# EAGLE design Rs232Iso-v1.1 (EAGLE 6.4)
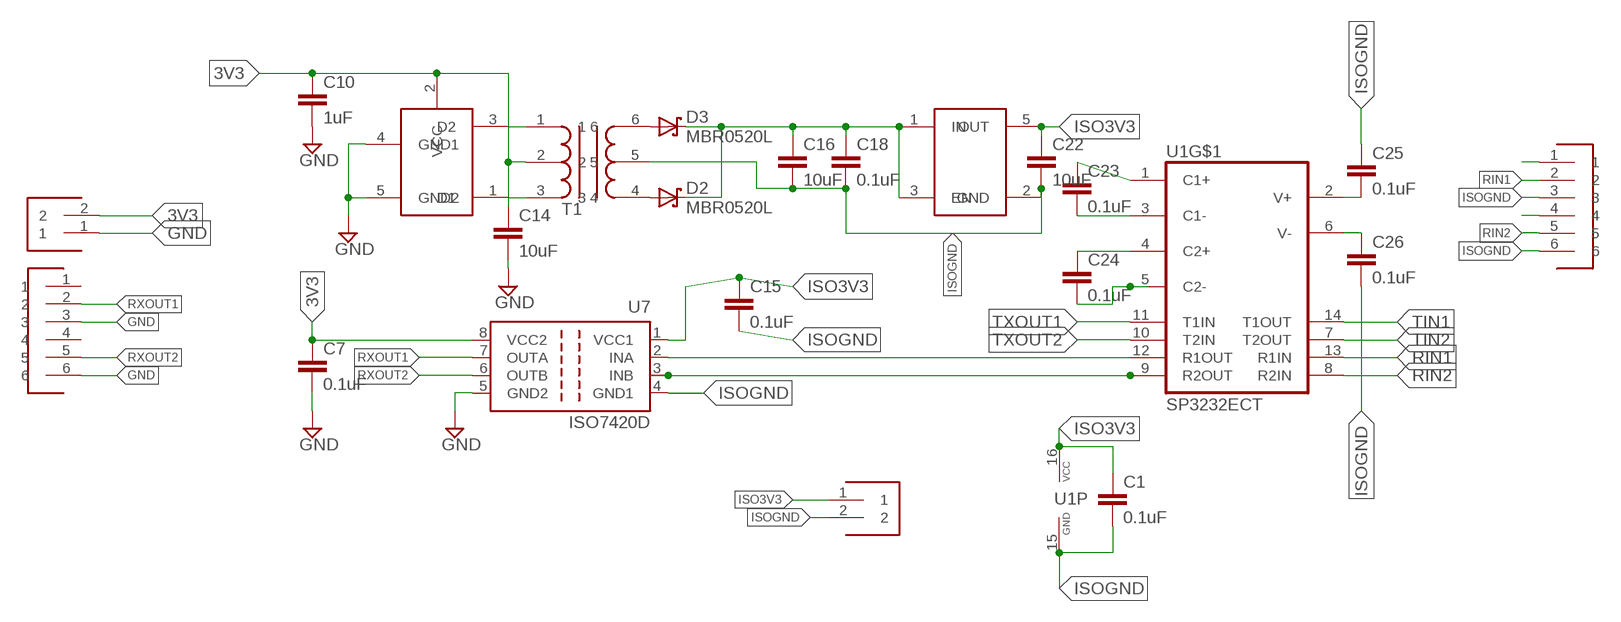
[diagram p0: schematic, sheet 1]

## Parts
C1  0.1uF  CAP0805  [0805]
C7  0.1uF  CAP0805  [0805]
C10  1uF  CAP0805  [0805]
C14  10uF  CAP0805  [0805]
C15  0.1uF  CAP0805  [0805]
C16  10uF  CAP0805  [0805]
C18  0.1uF  CAP0805  [0805]
C22  10uF  CAP0805  [0805]
C23  0.1uF  CAP0805  [0805]
C24  0.1uF  CAP0805  [0805]
C25  0.1uF  CAP0805  [0805]
C26  0.1uF  CAP0805  [0805]
D2  MBR0520L  [SOD123]
D3  MBR0520L  [SOD123]
J1  CON-2  [CON-2]
J2  CON-6  [CON-6]
J3  CON-2  [CON-2]
J4  CON-6  [CON-6]
T1  WE-PP-ISO-TRANSFORMER760390014  [WE_TRANSFORMER]
U1  SP3232ECT  [SO16]
U2  TPS76333  [SOT23-5L]
U5  SN6501DBVT  [SOT23-5L]
U7  ISO7420D  [SO08]

## Nets
3V3: C7.1 C10.1 C14.1 J1.2 T1.2 U5.2(VCC) U7.8(VCC2)
GND: C7.2 C10.2 C14.2 J1.1 J4.3 J4.6 U5.4(GND1) U5.5(GND2) U7.5(GND2)
ISO3V3: C1.1 C15.1 C22.1 J3.1 U1.16(P:VCC) U2.5(OUT) U7.1(VCC1)
ISOGND: C1.2 C15.2 C16.2 C18.2 C22.2 C25.1 C26.2 J2.3 J2.6 J3.2 T1.5 U1.15(P:GND) U2.2(GND) U7.4(GND1)
LDOIN: C16.1 C18.1 D2.C D3.C U2.1(IN) U2.3(EN)
N$1: D3.A T1.6
N$2: D2.A T1.4
N$3: J2.1
N$4: T1.1 U5.3(D2)
N$5: T1.3 U5.1(D1)
N$8: J2.4
N$10: C23.2 U1.3(C1-)
N$12: U1.12(R1OUT) U7.2(INA)
N$14: C24.1 U1.4(C2+)
N$15: U1.9(R2OUT) U7.3(INB)
N$18: C24.2 U1.5(C2-)
N$19: C23.1 U1.1(C1+)
RIN1: J2.2 U1.13(R1IN)
RIN2: J2.5 U1.8(R2IN)
RXOUT1: J4.2 U7.7(OUTA)
RXOUT2: J4.5 U7.6(OUTB)
TIN1: U1.14(T1OUT)
TIN2: U1.7(T2OUT)
TXOUT1: U1.11(T1IN)
TXOUT2: U1.10(T2IN)
V+: C25.2 U1.2(V+)
V-: C26.1 U1.6(V-)
Unconnected: J4.1 J4.4

## Library data of the parts
C1 C7 C10 C14-C16 C18 C22-C26 = __bo_caps:CAP
D2 D3 = __my:MBR0520L
J1 J3 = __my:CON-2
J2 J4 = __my:CON-6
T1 = __my:WE-PP-ISO-TRANSFORMER
U1 = __my:SP3232
U2 = __my:TPS76333
U5 = __my:SN6501DBVT
U7 = __my:ISO7420

## Board
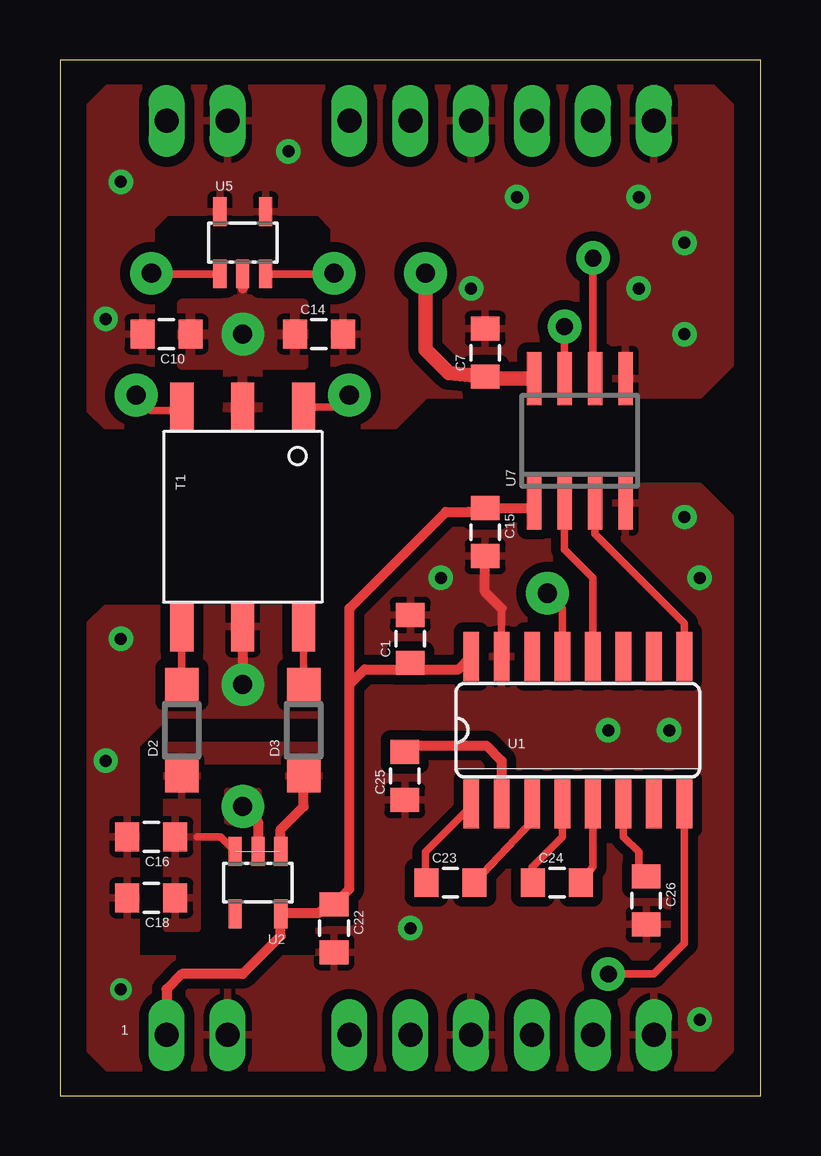
[diagram p1: board, top side]
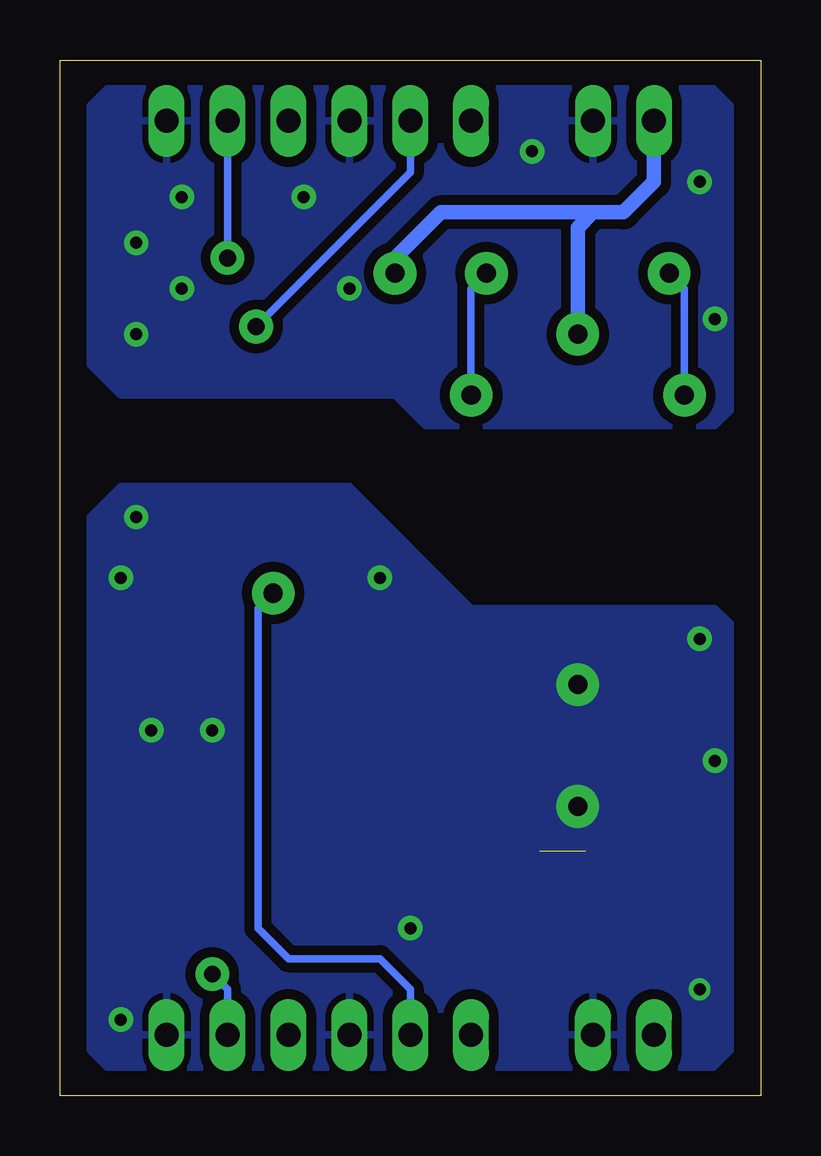
[diagram p2: board, bottom side, seen from below]

Size 29.21 x 43.18 mm. Coordinates in mm from the lower left corner, seen from the top.
Outline: 0,0 29.21,0 29.21,43.18 0,43.18 0,0
Copper layers (1*16): Top 0.035mm / dielectric 1.5mm / Bottom 0.035mm
Design rules "default *": minimum track width 10mil, minimum drill 22mil, track to track 8mil, track to pad 8mil, pad to pad 8mil, via to via 8mil, smd to smd 8mil, copper to edge 40mil, drill to drill 8mil, minimum pad ring 10mil, minimum via ring 8mil, stop-mask expansion 4mil, vias tented up to drill 20mil, thermal gap 10mil

### Footprints (pad centres in the part's own frame; a part is rotated, then mirrored left to right if it is on the bottom)
0805 = smd 1 x 1.2: 1 -1,0; 2 1,0
SOD123 = smd 1.4 x 1.4: A 1.9,0; C -1.9,0
CON-2 = drill 1 long: 1 0,1.27; 2 0,-1.27
CON-6 = drill 1 long: 1 0,6.35; 2 0,3.81; 3 0,1.27; 4 0,-1.27; 5 0,-3.81; 6 0,-6.35
WE_TRANSFORMER = smd 2.057 x 0.965: 1 -4.572,2.54; 2 -4.572,0; 3 -4.572,-2.54; 4 4.572,-2.54; 5 4.572,0; 6 4.572,2.54
SO16 = smd 0.66 x 2.032: 1 -4.445,-3.073; 2 -3.175,-3.073; 3 -1.905,-3.073; 4 -0.635,-3.073; 5 0.635,-3.073; 6 1.905,-3.073; 7 3.175,-3.073; 8 4.445,-3.073; 9 4.445,3.073; 10 3.175,3.073; 11 1.905,3.073; 12 0.635,3.073; 13 -0.635,3.073; 14 -1.905,3.073; 15 -3.175,3.073; 16 -4.445,3.073
SOT23-5L = smd 0.55 x 1.2: 1 -0.95,-1.3; 2 0,-1.3; 3 0.95,-1.3; 4 0.95,1.3; 5 -0.95,1.3
SO08 = smd 0.6 x 2.2: 1 -1.905,-2.6; 2 -0.635,-2.6; 3 0.635,-2.6; 4 1.905,-2.6; 5 1.905,2.6; 6 0.635,2.6; 7 -0.635,2.6; 8 -1.905,2.6

### Placement (x,y rotation side)
C1  14.61,19.05 90 top
C7  17.73,30.98 90 top
C10  4.45,31.75 180 top
C14  10.79,31.75 0 top
C15  17.73,23.5 270 top
C16  3.81,10.79 180 top
C18  3.81,8.26 180 top
C22  11.43,6.99 270 top
C23  16.28,8.89 0 top
C24  20.73,8.89 0 top
C25  14.38,13.34 90 top
C26  24.44,8.14 270 top
D2  5.08,15.24 90 top
D3  10.16,15.24 90 top
J1  5.71,40.64 270 top
J2  18.41,2.54 90 top
J3  5.71,2.54 90 top
J4  18.41,40.64 90 top
T1  7.62,24.13 270 top
U1  21.59,15.24 0 top
U2  8.26,8.89 180 top
U5  7.62,35.56 0 top
U7  21.67,27.3 0 top

### Tracks (layer width: path | path; a pad name or v marks a point on that pad's centre or on a via)
3V3  (via drill 0.8 pad 1.78)
  Top 0.305: C7.1 17.95,29.91
  Top 0.406: U5.2 7.62,33.66
  Top 0.61: C7.1 16.23,30.13 15.24,31.11 v15.24,34.29 | 17.95,29.91 U7.8
  Bottom 0.406: 7.62,36.71 7.5,36.71
  Bottom 0.61: v15.24,34.29 15.24,34.92 13.34,36.83 7.38,36.83 | J1.2 4.45,38.1 5.71,36.83 6.99,36.83 | 6.99,36.83 7.62,36.2 v7.62,31.75 | 6.99,36.83 7.38,36.83 | 7.38,36.83 7.5,36.71
  pour Top (isolate 0.406): 5.08,33.02 5.08,30.48 6.99,30.48 6.99,28.57 8.26,28.57 8.26,30.48 10.16,30.48 10.16,33.02 8.26,33.02 8.26,34.29 6.99,34.29 6.99,33.02
GND  (via drill 0.5 pad 1.02)
  other vias: 17.14,33.66 26.04,35.56 19.05,37.47 24.13,37.47 24.13,33.66 26.04,31.75 2.54,38.1 1.91,32.38 9.53,39.37
  pour Bottom (isolate 0.406): 1.27,41.27 2.54,42.55 26.67,42.55 27.94,41.27 27.94,30.48 26.67,29.21 15.24,29.21 13.97,27.94 1.91,27.94 1.27,28.57
  pour Top (isolate 0.406): 1.27,41.27 2.54,42.55 26.67,42.55 27.94,41.27 27.94,30.48 26.67,29.21 15.24,29.21 13.97,27.94 11.43,27.94 11.43,36.2 10.79,36.83 4.45,36.83 3.81,36.2 3.81,27.94 1.91,27.94 1.27,28.57
ISO3V3
  Top 0.305: U2.5 9.21,7.3
  Top 0.406: 12.06,17.14 12.06,8.62 C22.1 11.16,7.99 10.79,7.62 9.23,7.62 U2.5 9.21,6.67 7.62,5.08 5.08,5.08 4.45,4.45 J3.1 | 12.06,17.14 12.06,20.32 16.09,24.34 17.04,24.34 C15.1 19.55,24.5 U7.1 | 12.06,17.14 12.7,17.78 14.34,17.78 | 14.34,17.78 16.61,17.78 U1.16 | 14.34,17.78 C1.1
ISOGND  (via drill 0.5, 0.5 pad 1.02, 0.8 pad 1.78)
  Top 0.305: 18.41,19.05 U1.15 18.41,20.32 | v7.62,12.06 8.26,11.43
  Top 0.406: T1.5 v7.62,17.14 | 8.26,11.43 U2.2 | 18.41,20.32 17.73,21.01 C15.2
  other vias: 26.04,24.13 25.4,15.24 2.54,19.05 2.54,4.45 26.67,21.59 26.67,3.17 22.86,15.24 14.61,6.99 1.91,13.97 15.88,21.59
  pour Bottom (isolate 0.406): 1.27,19.68 1.91,20.32 12.06,20.32 17.14,25.4 26.67,25.4 27.94,24.13 27.94,1.91 26.67,0.64 2.54,0.64 1.27,1.91
  pour Top (isolate 0.406): 12.06,20.32 12.06,0.64 26.67,0.64 27.94,1.91 27.94,24.13 26.67,25.4 17.14,25.4
  pour Top (isolate 0.406): 1.27,19.68 1.91,20.32 3.17,20.32 3.17,5.71 10.79,5.71 10.79,20.32 12.06,20.32 12.06,0.64 2.54,0.64 1.27,1.91
  pour Top (isolate 0.406, rank 2): 6.99,12.7 6.99,11.43 8.26,11.43 8.26,12.7
  pour Top (isolate 0.406, rank 2): 3.17,20.32 10.79,20.32 10.79,15.88 4.45,15.88 3.17,14.61
LDOIN  (1 unrouted)
  Top 0.305: U2.3 6.7,10.79 5.71,10.79
  Top 0.406: U2.1 9.21,11.11 10.16,12.06 D3.C
  pour Top (isolate 0.406, rank 2): 4.45,14.61 10.79,14.61 10.79,12.7 9.53,12.7 9.53,13.97 5.71,13.97 5.71,6.99 4.45,6.99
N$1
  Top 0.305: T1.6 D3.A
N$2
  Top 0.305: T1.4 D2.A
N$4  (via drill 0.8 pad 1.78)
  Top 0.305: T1.1 11.56,28.7 v12.06,29.21 | U5.3 11.4,34.26 v11.43,34.29
  Bottom 0.305: v12.06,29.21 12.06,33.66 v11.43,34.29
N$5  (via drill 0.8 pad 1.78)
  Top 0.305: U5.1 3.84,34.26 v3.81,34.29 | v3.17,29.21 3.81,28.57 4.95,28.57 T1.3
  Bottom 0.305: v3.81,34.29 3.17,33.66 v3.17,29.21
N$10
  Top 0.305: U1.3 19.68,11.45 C23.2
N$12
  Top 0.305: U1.12 22.23,21.59 21.04,22.78 U7.2
N$14
  Top 0.305: U1.4 20.95,10.79 19.68,9.53 19.68,9.08 C24.1
N$15
  Top 0.305: U1.9 26.04,19.68 22.3,23.41 U7.3
N$18
  Top 0.305: U1.5 22.23,9.54 C24.2
N$19
  Top 0.305: U1.1 17.14,12.06 15.24,10.16 15.24,9.08 C23.1
RIN1  (via drill 0.8 pad 1.78)
  Top 0.305: v20.32,20.95 20.95,20.32 U1.13
  Bottom 0.305: v20.32,20.95 20.95,20.32 20.95,6.99 19.68,5.71 15.88,5.71 14.61,4.45 J2.2
RIN2  (via drill 0.7 pad 1.4)
  Top 0.305: U1.8 26.04,6.35 24.77,5.08 v22.86,5.08
  Bottom 0.305: J2.5 22.23,4.45 v22.86,5.08
RXOUT1  (via drill 0.7 pad 1.4)
  Top 0.305: v21.04,32.07 U7.7
  Bottom 0.305: J4.2 14.61,38.5 v21.04,32.07
RXOUT2  (via drill 0.7 pad 1.4)
  Top 0.305: v22.23,34.92 22.23,29.98 U7.6
  Bottom 0.305: J4.5 v22.23,34.92
V+
  Top 0.406: C25.2 14.64,14.61 17.78,14.61 18.41,13.97 U1.2
V-
  Top 0.305: U1.6 23.5,10.79 24.13,10.16 24.13,9.3 C26.1

### Text on the board
tPlace: 1